# EAGLE board SparkFun RTK Facet L-Band - Main (EAGLE 9.6.2)
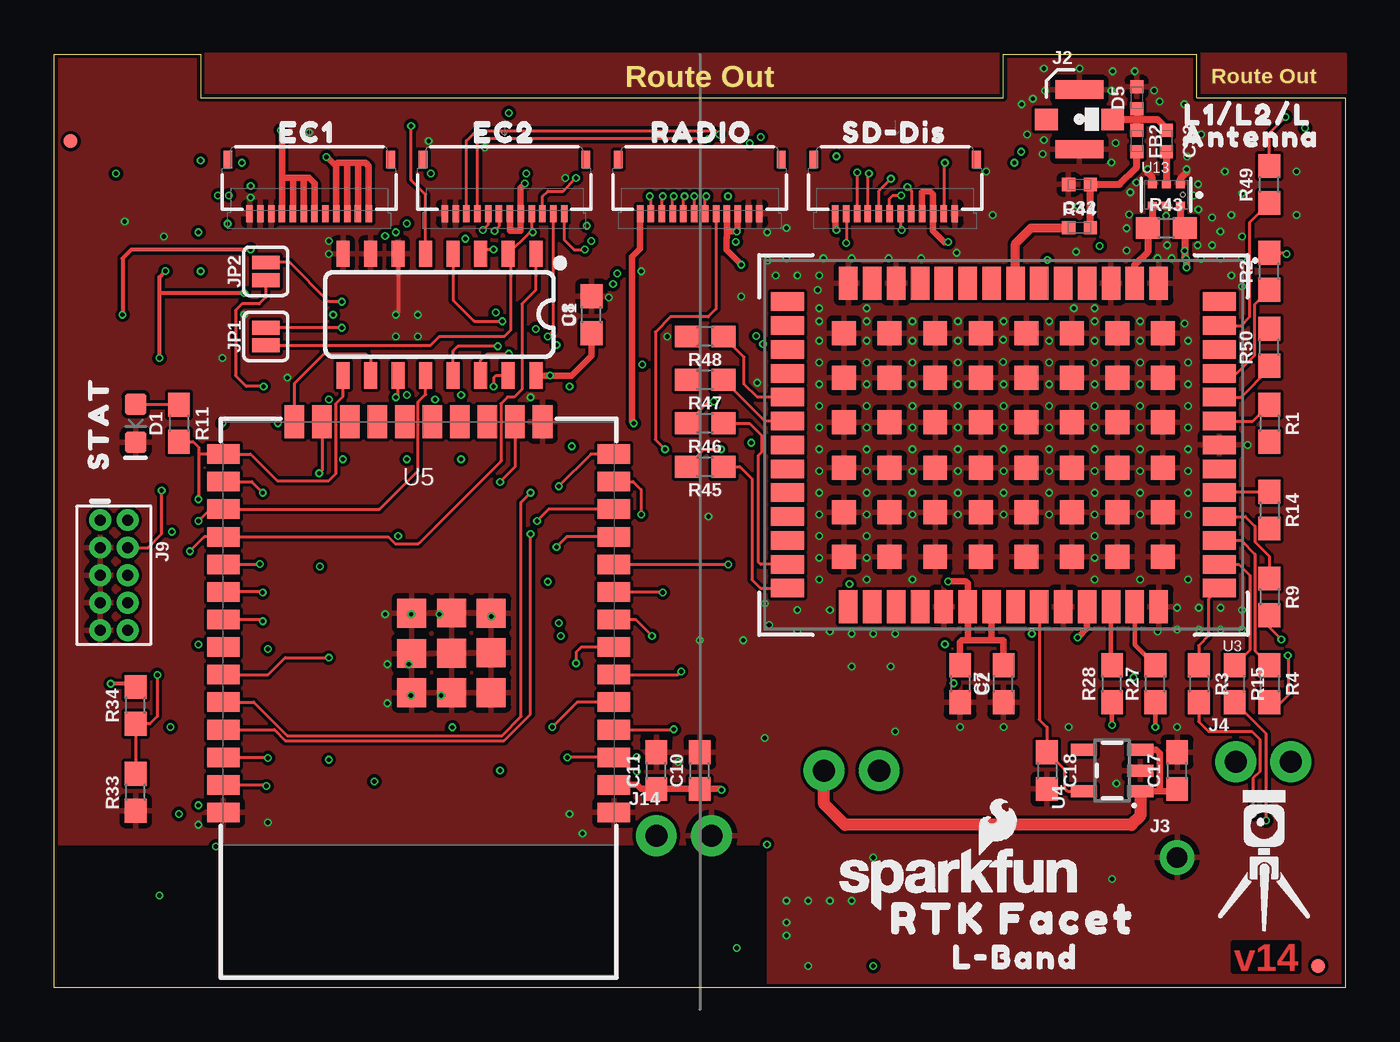
[diagram p2: board, top side]
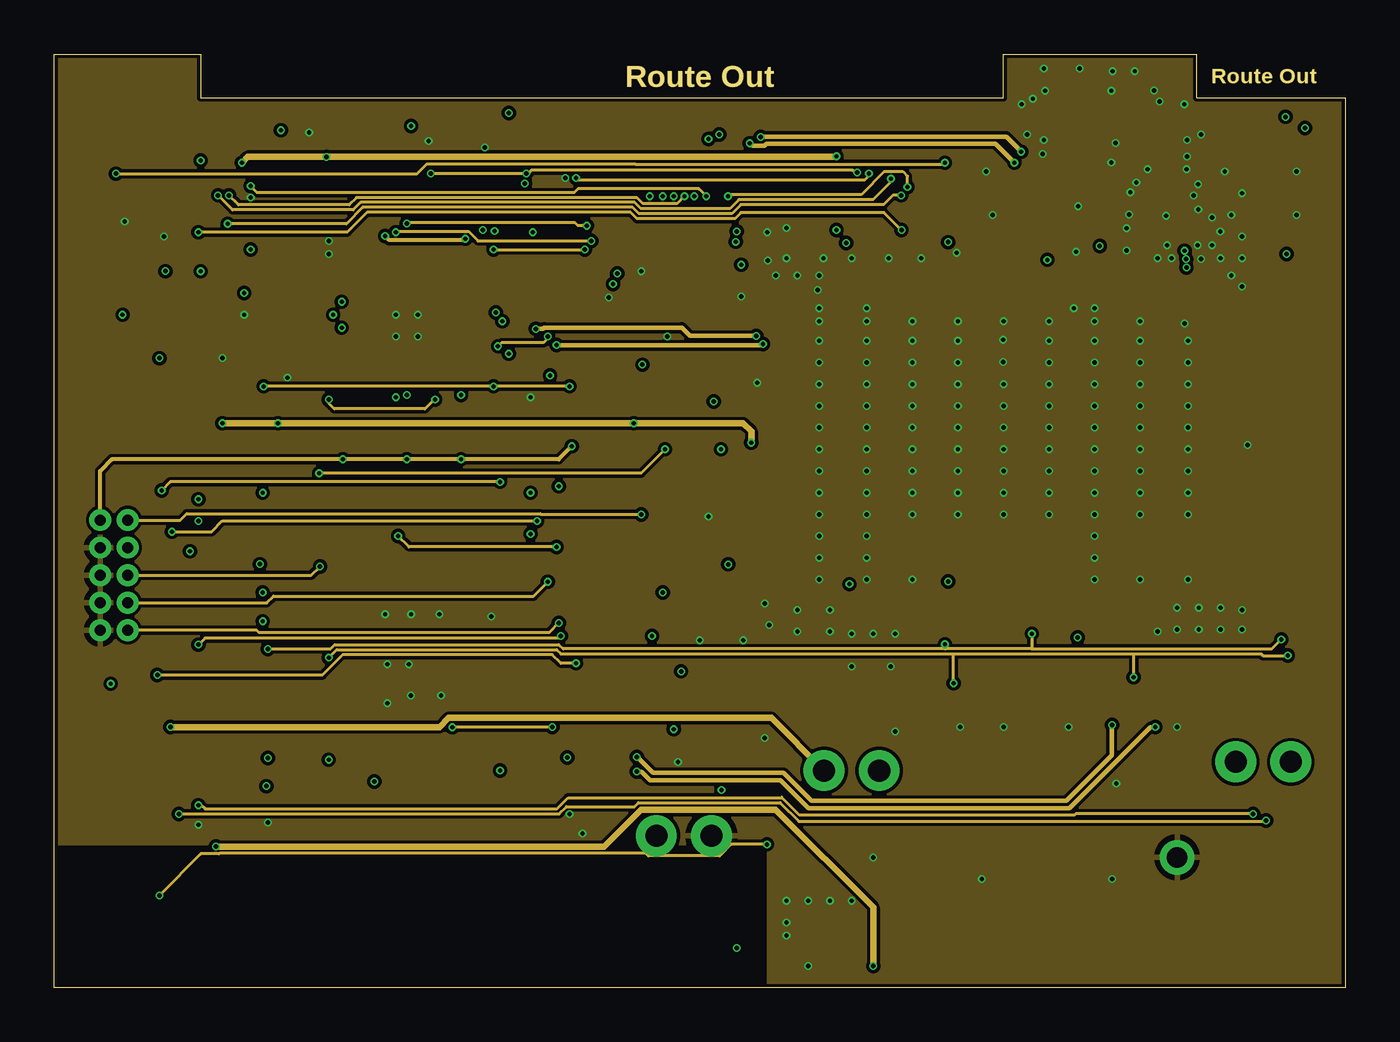
[diagram p3: board, inner layer GND/Horz]
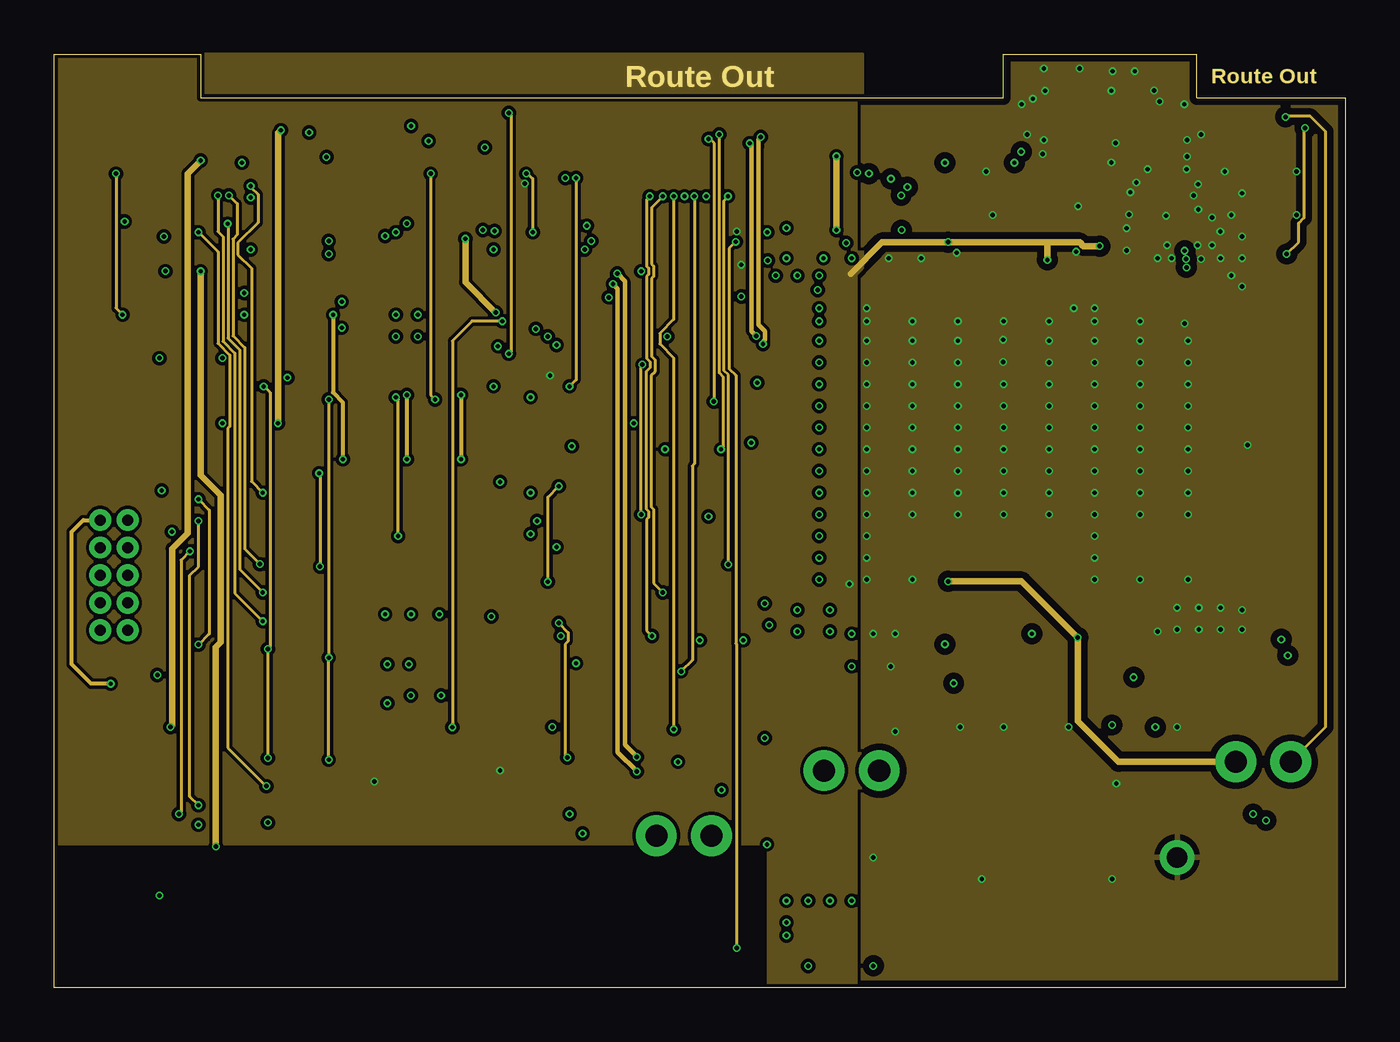
[diagram p4: board, inner layer 3.3V/Vert]
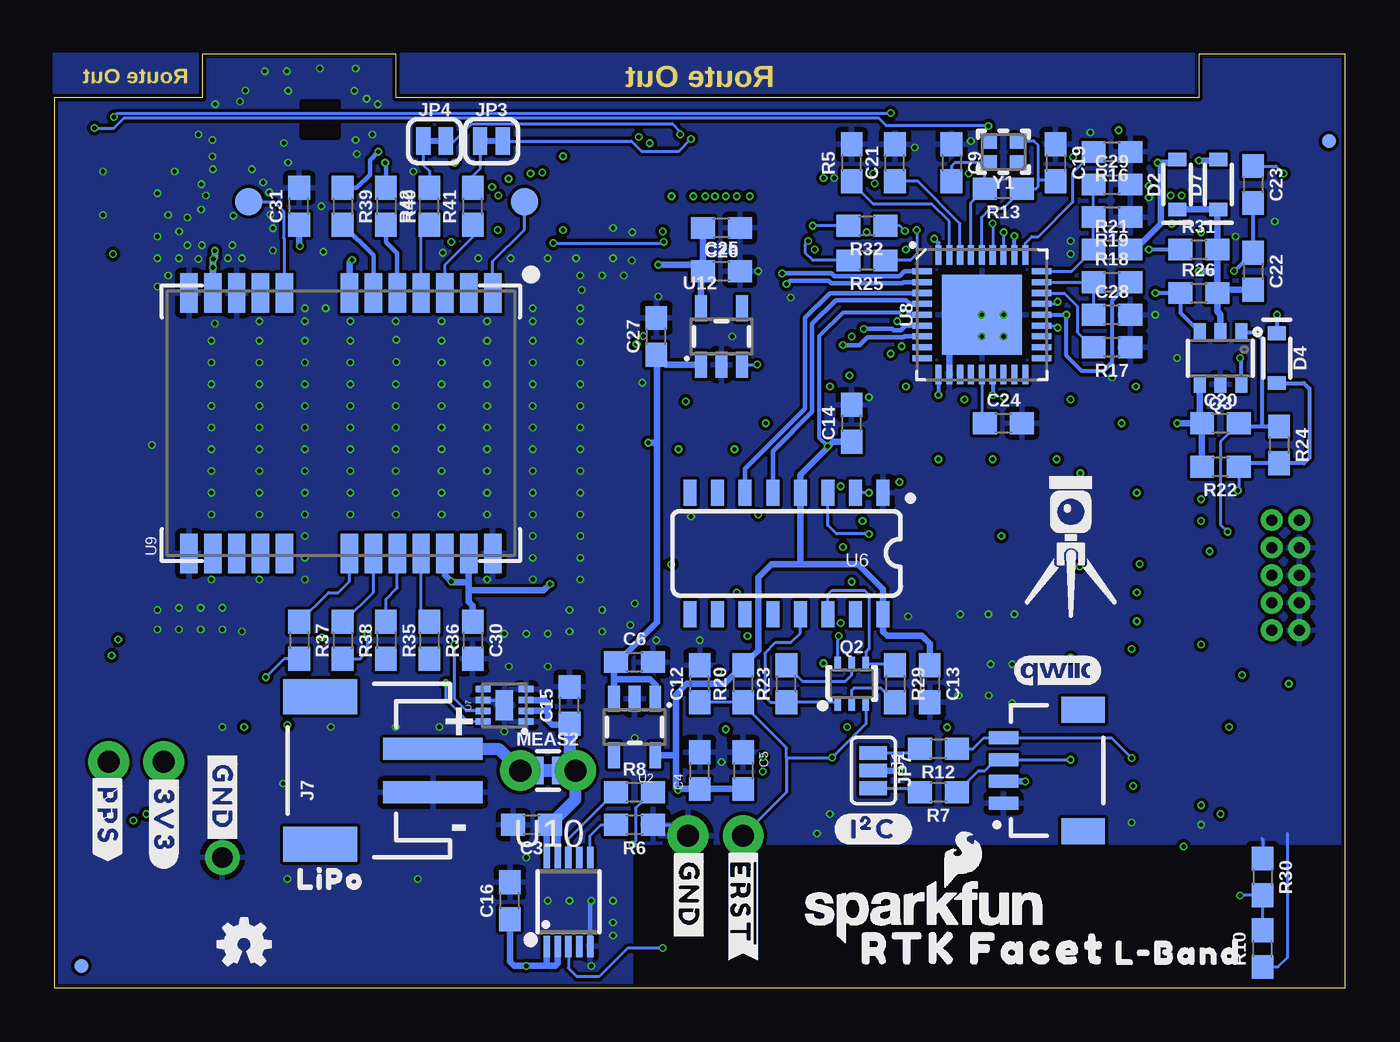
[diagram p5: board, bottom side, seen from below]

Size 59.5 x 43 mm. Coordinates in mm from the lower left corner, seen from the top.
Outline: 59.5,41 59.5,0 0,0 0,43 6.75,43 6.75,41 43.75,41 43.75,43 52.65,43 52.65,41 59.5,41
Copper layers (1+2*15+16): Top/Horz 0.035mm / dielectric 1.5mm / GND/Horz 0.035mm / dielectric 0.15mm / 3.3V/Vert 0.035mm / dielectric 0.2mm / Bottom/Vert 0.035mm
Design rules "SparkFun-4-Layer-MicroMod-JLCPCB": minimum track width 4mil, minimum drill 0.2mm, track to track 4mil, track to pad 4mil, pad to pad 4mil, via to via 4mil, smd to smd 4mil, copper to edge 6mil, drill to drill 6mil, minimum pad ring 3mil, minimum via ring 3mil, stop-mask expansion 2.5mil, vias tented up to drill 25mil, thermal gap 10mil
Net classes: 0 default: width 0.127 mm; 1 power: width 0.178 mm; 2 supply: width 0.406 mm; 3 RF: width 0.33 mm; 4 USB: width 0.203 mm, clearance 0.127 mm
tKeepout: area 0,0 to 2,43; area 57.5,0 to 59.5,43
bKeepout: area 0,0 to 2,43; area 57.5,0 to 59.5,43
tRestrict: area 9.2,35.5 to 9.3,35.8; area 9.7,35.5 to 9.8,35.8; area 18.1,35.5 to 18.4,35.8; area 32.1,35.5 to 32.4,35.8; area 10.2,35.5 to 10.3,35.8; area 18.6,35.5 to 18.9,35.8; area 31.7,35.5 to 31.8,35.8; area 50.2,36.2 to 52.3,36.8

## Footprints (pad centres in the part's own frame; a part is rotated, then mirrored left to right if it is on the bottom)
0603 = smd 1.1 x 1: 1 -0.85,0; 2 0.85,0
0402-TIGHT = smd 0.6 x 0.6: 1 -0.5,0; 2 0.5,0
LED-0603 = smd 1 x 1: A -0.877,0; C 0.877,0
SOD-323 = smd 0.63 x 0.83: A 1.15,0; C -1.15,0
JST04_1MM_RA = smd 0.6 x 1.35: 1 -1.5,0; 2 -0.5,0; 3 0.5,0; 4 1.5,0 | smd 1.2 x 2: NC1 2.8,-3.675; NC2 -2.8,-3.675
U.FL = smd 2.2 x 0.85: 1 0,1.375; 2 0,-1.375 | smd 1.05 x 1: FEED 1.525,0; NC -1.525,0
1X01_NO_SILK = drill 0.95 pad 1.6: 1 0,0
1X02_NO_SILK = drill 1.016 pad 1.88: 1 0,0; 2 2.54,0
JST-2-SMD = smd 1 x 4.6: 1 -1,-3.7; 2 1,-3.7 | smd 1.6 x 3.4: NC1 -3.4,1.5; NC2 3.4,1.5
FPC_12_DOUBLESIDED_BACKFLIP = smd 0.3 x 0.8: 1 -2.75,1.35; 2 -2.25,1.35; 3 -1.75,1.35; 4 -1.25,1.35; 5 -0.75,1.35; 6 -0.25,1.35; 7 0.25,1.35; 8 0.75,1.35; 9 1.25,1.35; 10 1.75,1.35; 11 2.25,1.35; 12 2.75,1.35 | smd 0.4 x 0.8: MP1 -3.75,-1.15; MP2 3.75,-1.15
2X5-PTH-1.27MM = drill 0.508 pad 1: 1 -2.54,-0.635; 2 -2.54,0.635; 3 -1.27,-0.635; 4 -1.27,0.635; 5 0,-0.635; 6 0,0.635; 7 1.27,-0.635; 8 1.27,0.635; 9 2.54,-0.635; 10 2.54,0.635
SMT-JUMPER_2_NO_SILK = smd 0.635 x 1.27: 1 -0.406,0; 2 0.406,0
SMT-JUMPER_2_NC_TRACE_SILK = smd 0.66 x 1.27: 1 -0.521,0; 2 0.521,0
SMT-JUMPER_3_NO_SILK = smd 0.635 x 1.27: 1 -0.813,0; 2 0,0; 3 0.813,0
FIDUCIAL-MICRO = smd 0.635 x 0.635: 1 0,0
COMBO-JUMPER_2_NC_TRACE = smd 0.635 x 1.27: 1 -0.508,0; 2 0.508,0 | drill 1.016 pad 1.88: 3 -1.27,0; 4 1.27,0
SC70-6 = smd 0.3 x 0.66: 1 -0.65,-0.92; 2 0,-0.92; 3 0.65,-0.92; 4 0.65,0.92; 5 0,0.92; 6 -0.65,0.92
SOT26 = smd 0.55 x 0.8: D1 -0.95,1.2; D2 0.95,1.2; G1 -0.95,-1.2; G2 0.95,-1.2; S1 0,1.2; S2 0,-1.2
PAD.03X.05 = smd 1.27 x 1.27: 1 0,0
SO16 = smd 0.6 x 1.2: 1 -4.445,-2.8; 2 -3.175,-2.8; 3 -1.905,-2.8; 4 -0.635,-2.8; 5 0.635,-2.8; 6 1.905,-2.8; 7 3.175,-2.8; 8 4.445,-2.8; 9 4.445,2.8; 10 3.175,2.8; 11 1.905,2.8; 12 0.635,2.8; 13 -0.635,2.8; 14 -1.905,2.8; 15 -3.175,2.8; 16 -4.445,2.8
SOT23-5 = smd 0.55 x 1.2: 1 -0.95,-1.3; 2 0,-1.3; 3 0.95,-1.3; 4 0.95,1.3; 5 -0.95,1.3
ZED-F9P = smd 0.85 x 1.52: 1 -7.15,-7.45; 2 -6.05,-7.45; 3 -4.95,-7.45; 4 -3.85,-7.45; 5 -2.75,-7.45; 6 -1.65,-7.45; 7 -0.55,-7.45; 8 0.55,-7.45; 9 1.65,-7.45; 10 2.75,-7.45; 11 3.85,-7.45; 12 4.95,-7.45; 13 6.05,-7.45; 14 7.15,-7.45; 28 7.15,7.45; 29 6.05,7.45; 30 4.95,7.45; 31 3.85,7.45; 32 2.75,7.45; 33 1.65,7.45; 34 0.55,7.45; 35 -0.55,7.45; 36 -1.65,7.45; 37 -2.75,7.45; 38 -3.85,7.45; 39 -4.95,7.45; 40 -6.05,7.45; 41 -7.15,7.45 | smd 1.52 x 0.85: 15 9.95,-6.6; 16 9.95,-5.5; 17 9.95,-4.4; 18 9.95,-3.3; 19 9.95,-2.2; 20 9.95,-1.1; 21 9.95,0; 22 9.95,1.1; 23 9.95,2.2; 24 9.95,3.3; 25 9.95,4.4; 26 9.95,5.5; 27 9.95,6.6; 42 -9.95,6.6; 43 -9.95,5.5; 44 -9.95,4.4; 45 -9.95,3.3; 46 -9.95,2.2; 47 -9.95,1.1; 48 -9.95,0; 49 -9.95,-1.1; 50 -9.95,-2.2; 51 -9.95,-3.3; 52 -9.95,-4.4; 53 -9.95,-5.5; 54 -9.95,-6.6 | smd 1.1 x 1.1: 55 -1.05,-1.05; 56 -3.15,-1.05; 57 -5.25,-1.05; 58 -7.35,-1.05; 59 -1.05,-3.1; 60 -3.15,-3.1; 61 -5.25,-3.1; 62 -7.35,-3.1; 63 -1.05,-5.15; 64 -3.15,-5.15; 65 -5.25,-5.15; 66 -7.35,-5.15; 67 -1.05,5.15; 68 -3.15,5.15; 69 -5.25,5.15; 70 -7.35,5.15; 71 -1.05,3.1; 72 -3.15,3.1; 73 -5.25,3.1; 74 -7.35,3.1; 75 -1.05,1.05; 76 -3.15,1.05; 77 -5.25,1.05; 78 -7.35,1.05; 79 1.05,1.05; 80 3.15,1.05; 81 5.25,1.05; 82 7.35,1.05; 83 1.05,3.1; 84 3.15,3.1; 85 5.25,3.1; 86 7.35,3.1; 87 1.05,5.15; 88 3.15,5.15; 89 5.25,5.15; 90 7.35,5.15; 91 1.05,-5.15; 92 3.15,-5.15; 93 5.25,-5.15; 94 7.35,-5.15; 95 1.05,-3.1; 96 3.15,-3.1; 97 5.25,-3.1; 98 7.35,-3.1; 99 1.05,-1.05; 100 3.15,-1.05; 101 5.25,-1.05; 102 7.35,-1.05
ESP-WROOM-32D-DFM_PASTE = smd 0.9 x 1.5: 1 6.43,9; 2 5.16,9; 3 3.89,9; 4 2.62,9; 5 1.35,9; 6 0.08,9; 7 -1.19,9; 8 -2.46,9; 9 -3.73,9; 10 -5,9; 11 -6.27,9; 12 -7.54,9; 13 -8.81,9; 14 -10.08,9; 25 -10.08,-9; 26 -8.81,-9; 27 -7.54,-9; 28 -6.27,-9; 29 -5,-9; 30 -3.73,-9; 31 -2.46,-9; 32 -1.19,-9; 33 0.08,-9; 34 1.35,-9; 35 2.62,-9; 36 3.89,-9; 37 5.16,-9; 38 6.43,-9 | smd 1.5 x 0.9: 15 -11.57,5.715; 16 -11.57,4.445; 17 -11.57,3.175; 18 -11.57,1.905; 19 -11.57,0.635; 20 -11.57,-0.635; 21 -11.57,-1.905; 22 -11.57,-3.175; 23 -11.57,-4.445; 24 -11.57,-5.715 | smd 1.33 x 1.33: GND -0.912,1.531; GNDT1 -2.751,3.346; GNDT2 -2.761,1.516; GNDT3 -2.751,-0.314; GNDT4 -0.891,-0.324; GNDT5 0.909,-0.314; GNDT6 0.909,1.516; GNDT7 0.909,3.346; GNDT8 -0.921,3.346
SO016 = smd 0.6 x 1.2: 1 -4.445,-2.8; 2 -3.175,-2.8; 3 -1.905,-2.8; 4 -0.635,-2.8; 5 0.635,-2.8; 6 1.905,-2.8; 7 3.175,-2.8; 8 4.445,-2.8; 9 4.445,2.8; 10 3.175,2.8; 11 1.905,2.8; 12 0.635,2.8; 13 -0.635,2.8; 14 -1.905,2.8; 15 -3.175,2.8; 16 -4.445,2.8
DFN-8 = smd 0.3 x 0.7: 1 -0.75,-0.99; 2 -0.25,-0.99; 3 0.25,-0.99; 4 0.75,-0.99; 5 0.75,0.99; 6 0.25,0.99; 7 -0.25,0.99; 8 -0.75,0.99 | smd 1.38 x 0.8: 9 0,0
QFN-36 = smd 0.9 x 0.28: 1 -2.75,2; 2 -2.75,1.5; 3 -2.75,1; 4 -2.75,0.5; 5 -2.75,0; 6 -2.75,-0.5; 7 -2.75,-1; 8 -2.75,-1.5; 9 -2.75,-2; 19 2.75,-2; 20 2.75,-1.5; 21 2.75,-1; 22 2.75,-0.5; 23 2.75,0; 24 2.75,0.5; 25 2.75,1; 26 2.75,1.5; 27 2.75,2 | smd 0.28 x 0.9: 10 -2,-2.75; 11 -1.5,-2.75; 12 -1,-2.75; 13 -0.5,-2.75; 14 0,-2.75; 15 0.5,-2.75; 16 1,-2.75; 17 1.5,-2.75; 18 2,-2.75; 28 2,2.75; 29 1.5,2.75; 30 1,2.75; 31 0.5,2.75; 32 0,2.75; 33 -0.5,2.75; 34 -1,2.75; 35 -1.5,2.75; 36 -2,2.75 | smd 3.7 x 3.7: EP 0,0
NEO-M9N/M8T/M8U/D9S/F9P = smd 1.8 x 0.8: 1 6,-7; 2 6,-5.9; 3 6,-4.8; 4 6,-3.7; 5 6,-2.6; 6 6,-1.5; 7 6,-0.4; 8 6,2.6; 9 6,3.7; 10 6,4.8; 11 6,5.9; 12 6,7; 13 -6,7; 14 -6,5.9; 15 -6,4.8; 16 -6,3.7; 17 -6,2.6; 18 -6,-0.4; 19 -6,-1.5; 20 -6,-2.6; 21 -6,-3.7; 22 -6,-4.8; 23 -6,-5.9; 24 -6,-7
MSOP10 = smd 0.3 x 1: 1 -1,-2.05; 2 -0.5,-2.05; 3 0,-2.05; 4 0.5,-2.05; 5 1,-2.05; 6 1,2.05; 7 0.5,2.05; 8 0,2.05; 9 -0.5,2.05; 10 -1,2.05
PD0922J5050S2HF_ANA = smd 0.41 x 0.33: 1 0.65,0.483; 2 0,0.483; 3 -0.65,0.483; 4 -0.65,-0.483; 5 0,-0.483; 6 0.65,-0.483
CRYSTAL-SMD-2.0X1.6MM = smd 0.75 x 0.7: 1 -0.675,-0.5; 2 0.675,-0.5; 3 0.675,0.5; 4 -0.675,0.5

## Placement (x,y rotation side)
C2  1.0uF  [0603]  41.75,14 270 top
C3  4.7uF  [0603]  37.5,7.5 180 bottom
C4  1.0uF  [0603]  29.75,10 90 bottom
C5  0.1uF  [0603]  27.75,10 270 bottom
C6  1.0uF  [0603]  32.75,15 0 bottom
C7  0.1uF  [0603]  43.75,14 90 top
C8  0.1uF  [0603]  24.76,31 90 top
C9  18pF  [0603]  18.15,38 270 bottom
C10  10uF  [0603]  29.75,10 90 top
C11  0.1uF  [0603]  27.75,10 90 top
C12  0.1uF  [0603]  29.75,14 90 bottom
C13  0.1uF  [0603]  19.15,14 270 bottom
C14  10uF  [0603]  22.75,26 90 bottom
C15  0.1uF  [0603]  35.75,13 90 bottom
C16  4.7uF  [0603]  38.5,4 90 bottom
C17  1.0uF  [0603]  51.75,10 90 top
C18  1.0uF  [0603]  45.75,10 270 top
C19  18pF  [0603]  13.35,38 270 bottom
C20  10uF  [0603]  5.75,26 0 bottom
C21  0.1uF  [0603]  20.75,38 90 bottom
C22  0.1uF  [0603]  4.25,33 270 bottom
C23  0.1uF  [0603]  4.25,37 270 bottom
C24  0.1uF  [0603]  15.75,26 0 bottom
C25  1.0uF  [0603]  28.75,33 0 bottom
C26  0.1uF  [0603]  28.75,35 180 bottom
C27  1.0uF  [0603]  31.75,30 90 bottom
C28  0.1uF  [0603]  10.75,31 0 bottom
C29  0.1uF  [0603]  10.75,37 0 bottom
C30  1.0uF  [0603]  40.21,16 270 bottom
C31  1.0uF  [0603]  48.21,36 90 bottom
C32  47pF  [0402-TIGHT]  47.25,37 180 top
C33  47pF  [0402-TIGHT]  51.25,39 270 top
D1  Yellow  [LED-0603]  3.75,26 270 top
D2  3A/10V/280mV  [SOD-323]  7.75,37 90 bottom
D4  250mA/100V  [SOD-323]  3.15,29 270 bottom
D5  PESD0402  [0402-TIGHT]  49.89,41 90 top
D7  3A/10V/280mV  [SOD-323]  5.85,37 90 bottom
FB2  2.66Ω  [0402-TIGHT]  49.89,39 270 top
FRAME1  FRAME-LEDGER  [CREATIVE_COMMONS]  83.51,6.35 0 top  (outside the outline)
FRAME2  FRAME-LEDGER  [CREATIVE_COMMONS]  83.51,6.35 0 top  (outside the outline)
J1  QWIIC_RIGHT_ANGLE  [JST04_1MM_RA]  15.75,10 90 bottom
J2  U.FL  [U.FL]  47.25,40 0 top
J3  [1X01_NO_SILK]  51.75,6 0 top
J4  [1X02_NO_SILK]  54.45,10.4 0 top
J7  [JST-2-SMD]  45.75,10 90 bottom
J8  [FPC_12_DOUBLESIDED_BACKFLIP]  38.75,37 180 top
J9  CORTEX_JTAG_DEBUG_PTH  [2X5-PTH-1.27MM]  2.75,19 270 top
J10  [FPC_12_DOUBLESIDED_BACKFLIP]  29.75,37 180 top
J14  [1X02_NO_SILK]  27.75,7 0 top
J15  [FPC_12_DOUBLESIDED_BACKFLIP]  11.75,37 180 top
J18  [FPC_12_DOUBLESIDED_BACKFLIP]  20.75,37 180 top
JP1  [SMT-JUMPER_2_NO_SILK]  9.75,30 90 top
JP2  [SMT-JUMPER_2_NO_SILK]  9.75,33 90 top
JP3  [SMT-JUMPER_2_NC_TRACE_SILK]  39.35,39 0 bottom
JP4  [SMT-JUMPER_2_NC_TRACE_SILK]  41.97,39 0 bottom
JP7  JUMPER-SMT_3_NO_SILK  [SMT-JUMPER_3_NO_SILK]  21.75,10 270 bottom
JP21  FIDUCIALUFIDUCIAL  [FIDUCIAL-MICRO]  58.25,1 0 top
JP61  FIDUCIALUFIDUCIAL  [FIDUCIAL-MICRO]  0.75,39 0 top
JP71  FIDUCIALUFIDUCIAL  [FIDUCIAL-MICRO]  58.25,1 0 bottom
JP81  FIDUCIALUFIDUCIAL  [FIDUCIAL-MICRO]  0.75,39 0 bottom
LOGO1  OSHW-LOGOMINI  [OSHW-LOGO-MINI]  50.75,2 0 bottom
LOGO2  SFE_LOGO_NAME_FLAME.1_INCH  [SFE_LOGO_NAME_FLAME_.1]  41.75,5 0 top
LOGO3  SFE_LOGO_NAME_FLAME.1_INCH  [SFE_LOGO_NAME_FLAME_.1]  19.35,3.5 0 bottom
MEAS2  JUMPER-COMBO_2_NC_TRACE  [COMBO-JUMPER_2_NC_TRACE]  36.75,10 0 bottom
Q2  MBT3904DW1T1  [SC70-6]  22.75,14 0 bottom
Q3  SIL2308  [SOT26]  5.75,29 180 bottom
R1  33  [0603]  56,26 270 top
R2  33  [0603]  56,33 90 top
R3  33  [0603]  52.75,14 270 top
R4  33  [0603]  56,14 270 top
R5  12k  [0603]  22.75,38 90 bottom
R6  1k  [0603]  32.75,7.5 180 bottom
R7  2.2k  [0603]  18.75,9 180 bottom
R8  0  [0603]  32.75,9 0 bottom
R9  33  [0603]  56,18 270 top
R10  10k  [0603]  3.81,1.8 90 bottom
R11  1k  [0603]  5.75,26 270 top
R12  2.2k  [0603]  18.75,11 180 bottom
R13  1M  [0603]  15.75,36.8 180 bottom
R14  33  [0603]  56,22 270 top
R15  33  [0603]  54.4,14 270 top
R16  100k  [0603]  10.75,38.5 180 bottom
R17  100k  [0603]  10.75,29.5 180 bottom
R18  100k  [0603]  10.75,32.5 0 bottom
R19  100k  [0603]  10.75,35.5 180 bottom
R20  10k  [0603]  27.75,14 90 bottom
R21  100k  [0603]  10.75,34 0 bottom
R22  10k  [0603]  5.75,24 180 bottom
R23  10k  [0603]  25.75,14 90 bottom
R24  300k  [0603]  3.05,25 270 bottom
R25  22  [0603]  22.05,33.5 180 bottom
R26  100k  [0603]  6.75,32 0 bottom
R27  27  [0603]  50.75,14 90 top
R28  27  [0603]  48.75,14 90 top
R29  10k  [0603]  20.75,14 270 bottom
R30  150k  [0603]  3.81,5.1 270 bottom
R31  10k  [0603]  6.75,34 0 bottom
R32  22  [0603]  22.05,35.1 180 bottom
R33  1k  [0603]  3.75,9 90 top
R34  4.7k  [0603]  3.75,13 90 top
R35  33  [0603]  44.21,16 270 bottom
R36  33  [0603]  42.21,16 270 bottom
R37  33  [0603]  48.21,16 270 bottom
R38  33  [0603]  46.21,16 270 bottom
R39  27  [0603]  46.21,36 270 bottom
R40  27  [0603]  44.21,36 270 bottom
R41  33  [0603]  40.21,36 90 bottom
R42  33  [0603]  42.21,36 90 bottom
R43  100  [0603]  51.25,35 0 top
R44  10  [0402-TIGHT]  47.25,35 0 top
R45  33  [0603]  30,24 180 top
R46  33  [0603]  30,26 180 top
R47  33  [0603]  30,28 180 top
R48  33  [0603]  30,30 180 top
R49  33  [0603]  56,37 90 top
R50  33  [0603]  56,29.5 90 top
TP1  TEST-POINT3X5  [PAD.03X.05]  50.53,36.21 180 bottom
TP2  TEST-POINT3X5  [PAD.03X.05]  37.83,36.21 180 bottom
U1  74HC4052D  [SO16]  17.75,31 180 top
U2  AP2112K-3.3V  [SOT23-5]  32.75,12 180 bottom
U3  U-BLOX_ZED-F9P  [ZED-F9P]  43.75,25 180 top
U4  STLQ015-3.3V  [SOT23-5]  48.75,10 90 top
U5  ESP-WROOM-3232D-DFMP  [ESP-WROOM-32D-DFM_PASTE]  16.79,14.5 270 top
U6  CH340C  [SO016]  25.75,20 180 bottom
U7  MAX17048  [DFN-8]  38.75,13 90 bottom
U8  USB251XB  [QFN-36]  16.75,31 0 bottom
U9  U-BLOX_NEO-D9S-00B  [NEO-M9N/M8T/M8U/D9S/F9P]  46.29,26 90 bottom
U10  MCP73833MSOP  [MSOP10]  35.8,3.95 0 bottom
U12  AP2112K-3.3V  [SOT23-5]  28.75,30 0 bottom
U13  POWER-DIVIDER  [PD0922J5050S2HF_ANA]  51.25,36.52 0 top
U$1  [LIPO0]  46.75,5 0 bottom
U$2  SPECIAL_INSTRUCTIONS-ORDERING  [ORDERING_INSTRUCTIONS]  63.5,81.28 0 top  (outside the outline)
U$3  [EC21]  20.75,39.4 0 top
U$4  [SD#DIS0]  38.75,39.4 0 top
U$5  [L#BAND0]  44.3,1.4 0 top
U$6  [#3V3#0]  54.45,7.7 270 bottom
U$7  [L#BAND0]  7.7,1.6 0 bottom
U$8  [EC10]  11.65,39.4 0 top
U$10  [#PPS#1]  57.05,7.9 270 bottom
U$11  [RTK_FACET0]  44.2,3.17 0 top
U$12  [RADIO0]  29.85,39.4 0 top
U$13  [RTK_FACET0]  16.65,1.8 0 bottom
U$14  [#GND#1]  51.75,11 270 bottom
U$15  [RTK5#SVG0]  55.76,5.84 0 top
U$16  [RTK5#SVG0]  12.65,20.3 0 bottom
U$17  [ANTENNA1]  55.15,39.21 0 top
U$18  [L1#L2#L0]  55.01,40.22 0 top
U$24  [STAT0]  2.05,26 90 top
U$25  [#I�C#0]  21.75,7.3 0 bottom
U$26  [##ERST##0]  27.75,3.9 270 bottom
U$30  [QWIIC_4MM]  13.25,14.6 0 bottom
U$84  [#GND#1]  30.25,6.5 270 bottom
Y1  24MHz  [CRYSTAL-SMD-2.0X1.6MM]  15.75,38.5 180 bottom

## Tracks (layer width: path | path; a pad name or v marks a point on that pad's centre or on a via)
3.3V  (via drill 0.2)
  Top/Horz 0.305: U1.16 v22.85,28.2 23.85,28.2 24.76,29.11 C8.1 | C7.2 43.75,16 43.25,16 43.24,16.01 | 43.24,16.01 43.2,16.05 U3.34 | v21.69,37.04 21.5,36.85 J18.5 21.5,34.87 21.02,34.87 21,34.89 J18.6 | J8.4 40,36.65 40.05,36.7 40.35,36.7 40.5,36.55 J8.3 40.5,34.86 41.02,34.34 v41.2,34.34 | J10.3 31.5,34.85 31.46,34.85 v31.45,34.84 31.04,34.84 31,34.8 | 43.24,16.01 42.09,16.01 | 42.09,16.01 41.84,16.01 41.75,15.92 C2.1 | 42.09,16.01 42.1,16.02 U3.33 42.1,18.62 42,18.71 v41.2,18.71 | U3.38 47.6,16.56 v47.17,16.13 | J10.4 31,34.8 | 31,34.8 31,34.56 30.98,34.54 30.98,33.99 v31.67,33.3
  3.3V/Vert 0.305: v48.19,34.16 47.44,34.16 47.27,34.33 45.73,34.33 | v45.77,33.53 45.77,34.29 45.73,34.33 | 36.72,32.89 38.15,34.33 41.25,34.33 | 45.73,34.33 41.25,34.33 | v41.2,34.34 41.24,34.34 41.25,34.33 | J4.1 49.05,10.4 47.17,12.28 v47.17,16.13 44.58,18.71 v41.2,18.71
  Bottom/Vert 0.305: C26.2 29.6,33.3 | 29.6,33.3 C25.1 29.7,32.9 U12.5 | v31.67,33.3 29.6,33.3 | J1.2 v14.75,9.5 | JP7.2 v20.55,10 | U9.7 45.89,33.41 v45.77,33.53 | C31.1 48.21,34.19 v48.19,34.16 | C30.1 40.21,17.59 40.4,17.78 40.4,18.3 | 40.4,18.3 40.4,18.67 | 40.4,18.67 U9.23 | U9.22 41.49,19 v41.2,18.71 41.15,18.67 40.4,18.67 | 40.4,18.3 36.94,18.3 v36.65,18.59
  pour 3.3V/Vert (isolate 0.152, rank 4): 0,43 37.25,43 37.25,0 0,0
CHG_LED  (via drill 0.2)
  Top/Horz 0.127: v36.5,34.3 J8.11
  3.3V/Vert 0.127: v31.45,1.82 31.45,15.82 31.41,15.86 31.41,28.2 31.11,28.51 31.11,34.06 v31.41,34.36
  Bottom/Vert 0.127: v31.41,34.36 31.47,34.3 v36.5,34.3 | U10.3 35.8,0.9 35.4,0.5 34.4,0.5 33.08,1.82 v31.45,1.82
CHG_THERM1  (via drill 0.2)
  GND/Horz 0.127: v32.85,6.6 31.2,6.6 30.67,6.07 27.37,6.07 27.26,6.18 7.62,6.18 7.59,6.16 6.76,6.16 v4.85,4.25
  Bottom/Vert 0.127: R10.2 R30.2 v4.85,4.25 | v32.85,6.6 32.72,6.74 32.72,8.27 31.98,9 R8.2
ESP32_!DTR
  Bottom/Vert 0.127: Q2.1 23.47,13.15 R23.1 26.5,13.15 26.75,13.4 26.75,15.4 26.25,15.9 25.55,15.9 25.11,16.34 U6.13
ESP32_!RTS
  Bottom/Vert 0.127: R29.1 20.82,14.92 Q2.4 22.1,15.46 21.95,15.61 21.95,18.1 22.15,18.3 23.65,18.3 23.84,18.11 U6.14
ESP32_EN  (via drill 0.2)
  Top/Horz 0.127: U5.3 v23.66,10.61 v23.65,10.6
  GND/Horz 0.127: J9.10 9.34,16.46 9.44,16.36 22.81,16.36 v23.25,16.8
  3.3V/Vert 0.127: v23.25,16.8 23.69,16.36 23.69,15.96 23.55,15.82 23.55,10.7 v23.65,10.6
  Bottom/Vert 0.127: R20.1 27.85,13.15 | 27.85,13.15 C12.1 | 27.85,13.15 25.75,11.05 25.75,10.6 | 25.75,10.6 v23.65,10.6 22.1,12.15 Q2.3 | 25.75,10.6 25.75,9 J14.1
ESP32_RXI  (via drill 0.2)
  Top/Horz 0.127: v21.95,22.8 21.52,22.37 21.52,12.49 20.64,11.61 10.74,11.61 9.2,13.15 U5.34
  Bottom/Vert 0.127: v21.95,22.8 U6.2
ESP32_TXO  (via drill 0.2)
  Top/Horz 0.127: v21.95,20.9 21.95,12.6 20.73,11.38 10.65,11.38 10.15,11.88 U5.35
  Bottom/Vert 0.127: v21.95,20.9 23.45,20.9 23.84,21.3 U6.3
ESP_0/BOOT/STAT_LED/MUX_B  (via drill 0.2)
  Top/Horz 0.127: U1.9 13.3,27.23 12.96,26.89 12.96,23.67 12.65,23.36 10.27,23.36 9.05,24.58 U5.25 6.71,24.58 6.65,24.64 | R11.2 6.4,25.15 6.65,24.9 6.65,24.64 | 6.65,24.64 v6.65,22.5
  GND/Horz 0.127: v23.35,16.2 23.25,16.1 6.95,16.1 v6.65,15.8
  3.3V/Vert 0.127: v6.65,22.5 7.15,22 7.15,16.3 v6.65,15.8
  Bottom/Vert 0.127: v23.35,16.2 23.4,16.15 Q2.6
ESP_2/MUX_A
  Top/Horz 0.127: U5.24 11.07,27.84 12.43,29.2 14.35,29.2 14.57,28.98 U1.10
ESP_3V3  (via drill 0.2)
  Top/Horz 0.178: R34.2 3.6,14 v2.6,14
  Top/Horz 0.305: v30.75,9.1 30.7,9.15 C10.1 C11.1 27.05,9.15 26.86,9.34 U5.2
  GND/Horz 0.178: J9.1 2.12,23.8 2.66,24.34 v13.3,24.34 v16.25,24.34 v18.75,24.34 23.25,24.34 v23.85,24.94 | v18.95,34.5 18.95,34.48 18.9,34.43 15.44,34.43 v15.25,34.63
  3.3V/Vert 0.178: v12.85,31 12.85,27.42 13.3,26.97 v13.3,24.34 | v16.25,27.3 v16.25,24.34 | v18.75,27.3 v18.75,24.34 | v2.6,14 1.7,14 0.8,14.9 0.8,21 1.34,21.54 J9.1
  3.3V/Vert 0.305: v18.95,34.5 18.95,32.5 v20.35,31.1
  Bottom/Vert 0.178: U8.10 v18.75,27.3 | U8.5 20.3,31 20.35,31.05 v20.35,31.1 23.15,31.1 24.25,30 24.25,25.34 v23.85,24.94 | U8.36 18.75,34.3 v18.95,34.5 | U8.29 v15.25,34.63 | U8.23 v12.85,31 12.85,29.1 12.15,28.4 11.15,28.4 10.75,28.8 10.75,31.65 R18.2 | U8.15 v16.25,27.3
  Bottom/Vert 0.305: 30.85,10.7 30.85,13.5 30.35,14 28.6,14 R20.2 27.05,15.55 27.05,18.9 26.45,19.5 25.15,19.5 | 30.85,10.7 30.85,9.2 v30.75,9.1 30.7,9.15 C10.1 C11.1 | U2.5 30.85,10.7 | 30.85,10.7 | C13.1 19.15,15.85 19.5,16.2 21.11,16.2 21.3,16.4 U6.16 21.3,18.34 21.3,18.35 22.45,19.5 25.15,19.5 | 25.15,19.5 25.11,19.54 U6.4 25.11,23.64 23.85,24.9 | C14.1 23.6,25.15 23.85,24.9 | v23.85,24.94 23.85,24.9
ESP_4/RADIO_PWR_ON  (via drill 0.2)
  Top/Horz 0.127: J10.6 30,36.41 v30.05,36.46 | U5.26 9.1,23.31 v9.61,22.8
  GND/Horz 0.127: v30.05,36.46 29.71,36.8 24.13,36.8 23.96,36.63 9.35,36.63 v9.05,36.93
  3.3V/Vert 0.127: v9.05,36.93 9.05,36.88 9.39,36.54 9.39,35.24 8.46,34.31 8.46,33.77 9.09,33.14 9.09,23.32 v9.61,22.8
ESP_5/RADIO_CTSI  (via drill 0.2)
  Top/Horz 0.127: J10.8 29,36.41 v29.05,36.46 | U5.29 v9.48,19.51
  GND/Horz 0.127: v8.05,36.5 8.49,36.06 13.59,36.06 13.93,36.4 26.85,36.4 27.13,36.12 28.69,36.12 29.03,36.46 v29.05,36.46
  3.3V/Vert 0.127: v8.05,36.5 8.44,36.11 8.44,34.69 8.24,34.49 8.24,30.02 8.78,29.48 8.78,20.21 v9.48,19.51
ESP_12/MTDI  (via drill 0.2)
  Top/Horz 0.127: U5.14 24.73,24.58 v23.25,23.1
  GND/Horz 0.127: J9.8 9.79,17.73 10.1,18.04 22.09,18.04 v22.75,18.7
  3.3V/Vert 0.127: v22.75,18.7 22.75,22.6 v23.25,23.1
ESP_13/POWER_CTRL/MTCK  (via drill 0.2)
  Top/Horz 0.127: J9.4 4.32,20.27 4.95,20.9 v4.95,22.9 | U5.16 21.23,23.98 v20.55,23.3
  GND/Horz 0.127: v20.55,23.3 5.35,23.3 v4.95,22.9
  Bottom/Vert 0.127: v4.95,22.9 4.88,22.98 4.88,24.02
  Bottom/Vert 0.178: D4.A 1.9,27.85 1.65,27.6 1.65,24.4 1.9,24.15 R24.2 4.75,24.15 4.88,24.02 R22.1
ESP_14/PERIPHERAL_POWER/MTMS  (via drill 0.2)
  Top/Horz 0.127: U5.13 26.68,23.31 27.05,22.94 v27.05,21.8
  GND/Horz 0.127: J9.2 5.81,21.54 6.11,21.84 22.39,21.84 22.43,21.8 v27.05,21.8
  3.3V/Vert 0.127: v27.05,21.8 27.05,28.64 v27.11,28.7
  Bottom/Vert 0.127: U12.3 v27.11,28.7
ESP_15/MTDO/RADIO_!RESET!  (via drill 0.2)
  Top/Horz 0.127: J10.5 30.5,31.27 30.13,30.9 28.4,30.9 27.7,30.2 27.7,25.25 v28.15,24.8 | U5.23 12.35,23.84 v12.21,23.7
  GND/Horz 0.127: v28.15,24.8 27.05,23.7 v12.21,23.7 | J9.6 11.85,19 v12.25,19.4
  3.3V/Vert 0.127: v12.21,23.7 12.25,23.66 v12.25,19.4
ESP_16/ZED_TXO1  (via drill 0.2)
  Top/Horz 0.127: U1.12 17.11,27.33 16.77,26.99 16.77,23.82 14.99,22.04 U5.27 7.19,22.04 v6.65,21.5 | v55.25,8 55.25,9.64 55.55,9.94 55.55,11.45 55.2,11.8 53.2,11.8 52.75,12.25 R3.2
  GND/Horz 0.127: v55.25,8 47.07,8 47.02,7.94 34.36,7.94 33.52,8.78 33.5,8.75 23.69,8.75 23.17,8.23 6.95,8.23 6.78,8.4 v6.65,8.4
  3.3V/Vert 0.127: v6.65,21.5 6.65,19.4 6.25,19 6.25,8.8 v6.65,8.4
ESP_17/ZED_RXI1  (via drill 0.2)
  Top/Horz 0.127: U1.1 22.2,32.15 21.55,31.5 21.55,27.56 21.19,27.2 20.89,27.2 20.59,26.9 20.59,24.26 16.79,20.46 15.71,20.46 15.4,20.77 U5.28 6.92,20.77 v6.25,20.1 | v55.85,7.7 55.85,11.7 R15.2
  GND/Horz 0.127: v55.85,7.7 55.81,7.66 34.32,7.66 33.46,8.52 26.92,8.52 26.74,8.34 23.61,8.34 23.27,8 v5.75,8
  3.3V/Vert 0.127: v6.25,20.1 5.85,19.7 5.85,8.1 v5.75,8
ESP_18/SD_SCK  (via drill 0.2)
  Top/Horz 0.127: J8.7 38.5,36.35 38.65,36.5 v39.03,36.5 | v9.61,18.21 9.59,18.23 U5.30
  GND/Horz 0.127: v39.03,36.5 38.65,36.5 38.22,36.07 31.64,36.07 31.23,35.66 26.94,35.66 26.66,35.94 14.22,35.94 13.47,35.19 v7.99,35.19
  3.3V/Vert 0.127: v9.61,18.21 8.55,19.27 8.55,29.38 8.01,29.93 8.01,35.17 v7.99,35.19
ESP_19/SD_CIPO  (via drill 0.2)
  Top/Horz 0.127: J8.8 38,36.7 v38.56,37.26 | U5.31 9.53,16.96 v9.61,16.88
  GND/Horz 0.127: v38.56,37.26 38.56,37.13 37.72,36.3 31.55,36.3 31.14,35.89 27.04,35.89 26.75,36.17 14.13,36.17 13.79,35.83 8.22,35.83 v7.55,36.5
  3.3V/Vert 0.127: v7.55,36.5 7.55,34.82 7.78,34.59 7.78,29.78 8.32,29.24 8.32,18.17 v9.61,16.88
ESP_21/SDA  (via drill 0.2)
  Top/Horz 0.127: v37,37.55 J8.10 | JP1.1 17.34,29.59 17.75,30 20.75,30 21.05,30.3 21.05,33.8 U1.2 21.93,34.8 v22.05,34.8 22,34.85 J18.4 | v12.65,15.2 10.65,15.2 9.87,14.42 U5.33 | R4.2 56.55,13.15 56.9,13.5 56.9,15.25 v56.85,15.3
  GND/Horz 0.127: v17.55,27.1 17.53,27.1 17.09,26.66 12.91,26.66 12.65,26.92 v12.65,27.1 | v17.35,37.5 v21.75,37.5 21.85,37.5 22.01,37.66 36.79,37.66 36.9,37.55 v37,37.55 | v12.65,15.2 13.02,15.57 23.16,15.57 23.36,15.37 41.45,15.37 | v56.85,15.3 55.71,15.3 55.64,15.37 49.75,15.37 | 41.45,15.37 49.75,15.37 | v49.75,14.3 49.75,15.37 | v41.45,14.02 41.45,15.37
  3.3V/Vert 0.127: v17.35,37.5 17.35,27.3 v17.55,27.1 | v12.65,27.1 v12.65,15.2 v12.65,10.5 | v21.75,37.5 21.82,37.5 22.05,37.27 v22.05,34.8
  Bottom/Vert 0.127: U7.8 40.42,12.25 41.45,13.28 v41.45,14.02 | v12.65,10.5 J1.3 16.1,10.5 16.6,10 16.9,10 R7.1 | R37.2 48.9,15.15 v49.75,14.3
ESP_22/SCL  (via drill 0.2)
  Top/Horz 0.127: J8.9 37.5,37.45 v37.55,37.5 | J18.3 22.5,36.45 22.75,36.7 23.45,36.7 v24.05,37.3 | JP2.1 9.75,31.8 9.45,31.5 8.65,31.5 8.35,31.2 8.35,28.2 8.85,27.7 v9.65,27.7 | U1.15 20.35,28.2 20.25,28.1 v20.25,27.7 | U5.36 9.82,10.61 v9.85,10.58 | R9.2 56,16.59 v56.55,16.04
  GND/Horz 0.127: 45.05,15.6 41.05,15.6 | v37.55,37.5 37.55,37.4 37.35,37.2 24.15,37.2 v24.05,37.3 | v23.75,27.7 v20.25,27.7 v9.65,27.7 | v9.85,15.6 12.73,15.6 12.93,15.8 23.25,15.8 23.45,15.6 41.05,15.6 | v45.06,16.3 45.06,15.61 45.05,15.6 | v41.05,15.82 41.05,15.6 | v56.55,16.04 56.11,15.6 45.05,15.6
  3.3V/Vert 0.127: v9.85,10.58 v9.85,15.6 9.95,15.7 9.95,27.42 9.67,27.7 v9.65,27.7 | v24.05,37.3 24.05,28 v23.75,27.7
  Bottom/Vert 0.127: U7.7 40.5,12.75 41.05,13.3 v41.05,15.82 | v9.85,10.58 10.77,11.5 J1.4 16.65,11.5 17.15,11 R12.1 | R38.2 45.4,15.15 45.06,15.49 v45.06,16.3
ESP_23/SD_COPI  (via drill 0.2)
  Top/Horz 0.127: J8.6 39,34.95 v39.05,34.9 | U5.37 9.72,9.34 v9.78,9.28
  GND/Horz 0.127: v39.05,34.9 38.25,35.7 31.65,35.7 31.38,35.43 26.85,35.43 26.57,35.71 14.42,35.71 13.5,34.8 v6.65,34.8
  3.3V/Vert 0.127: v6.65,34.8 7.55,33.9 7.55,29.68 8.09,29.14 8.09,25.86 8,25.77 8,11.06 v9.78,9.28
ESP_25/SD_!CS!  (via drill 0.2)
  Top/Horz 0.127: v39.32,36.88 39.5,36.7 J8.5 | U5.10 v31.07,19.5
  GND/Horz 0.127: v39.32,36.88 39.32,37.39 39.11,37.6 38.27,37.6 37.2,36.53 31.12,36.53 v31.05,36.46
  3.3V/Vert 0.127: v31.05,36.46 31.07,36.44 30.88,36.25 30.88,28.41 31.07,28.22 v31.07,19.5
ESP_26/DAC2  (via drill 0.2)
  Top/Horz 0.127: v15.75,27.2 15.85,27.3 U1.11 | U5.11 23.62,20.77 v23.15,20.3
  GND/Horz 0.127: v23.15,20.3 16.35,20.3 v15.85,20.8
  3.3V/Vert 0.127: v15.85,20.8 15.85,27.1 v15.75,27.2
ESP_27/FAST_OFF  (via drill 0.2)
  Top/Horz 0.127: U5.12 22.79,22.04 v22.25,21.5
  GND/Horz 0.127: v22.25,21.5 7.75,21.5 7.25,21 v5.42,21
  Bottom/Vert 0.127: C20.2 5.75,25.15 5.75,21.33 v5.42,21
  Bottom/Vert 0.178: Q3.G1 4.15,30.2 3.85,29.9 3.85,25.85 | R24.1 3.85,25.85 | 3.85,25.85 4.75,25.85 C20.2
ESP_32/RADIO_TXO  (via drill 0.2)
  Top/Horz 0.127: J10.11 27.5,36.41 v27.45,36.46 | U5.8 26.79,16.96 v27.55,16.2
  3.3V/Vert 0.127: v27.45,36.46 27.3,36.31 27.3,33.23 27.39,33.14 27.39,32.86 27.3,32.77 27.3,28.99 27.45,28.84 27.45,28.55 27.28,28.38 27.28,22.05 27.39,21.94 27.39,21.66 27.3,21.57 27.3,16.45 v27.55,16.2
ESP_33/RADIO_RXI  (via drill 0.2)
  Top/Horz 0.127: J10.10 28,36.41 v28.05,36.46 | U5.9 28.02,18.23 v28.05,18.2
  3.3V/Vert 0.127: v28.05,36.46 27.53,35.94 27.53,33.33 27.62,33.24 27.62,32.76 27.53,32.67 27.53,29.09 27.68,28.94 27.68,28.38 27.51,28.21 27.51,22.15 27.62,22.04 27.62,18.63 v28.05,18.2
ESP_DM
  Bottom/Vert 0.203: U8.3 23.75,32 24.9,30.85 24.9,26.67 27.66,23.91 U6.6
ESP_DP
  Bottom/Vert 0.203: U6.5 26.39,24.71 24.57,26.53 24.57,30.58 23.48,31.67 20.24,31.67 20.07,31.5 U8.4
ESP_I34/RADIO_INT  (via drill 0.2)
  Top/Horz 0.127: J10.7 v29.5,36.45 v29.5,36.46 | U5.6 28.74,14.42 v28.89,14.57
  3.3V/Vert 0.127: v29.5,36.46 29.5,24.14 29.41,24.04 29.41,15.09 v28.89,14.57
ESP_I35/DEVICE_SENSE  (via drill 0.2)
  Top/Horz 0.127: v4.75,14.4 4.75,12.5 4.4,12.15 R34.1 R33.2 | U5.7 24.28,15.69 24.05,15.46 v24.05,14.94
  GND/Horz 0.127: v4.75,14.4 12.35,14.4 13.29,15.34 22.95,15.34 23.35,14.94 v24.05,14.94
ESP_I36/RADIO_RTSO  (via drill 0.2)
  Top/Horz 0.127: J10.9 28.5,36.41 v28.55,36.46 | U5.4 28.53,11.88 v28.55,11.9
  3.3V/Vert 0.127: v28.55,36.46 28.55,30.78 27.91,30.14 27.91,29.66 28.55,29.02 v28.55,11.9
ESP_I39/ADC39  (via drill 0.2)
  Top/Horz 0.127: U5.5 24.1,13.15 v22.95,12 | U1.4 18.39,31.66 19.35,30.7 v20.65,30.7
  GND/Horz 0.127: v22.95,12 v18.36,12 v18.35,11.99
  3.3V/Vert 0.127: v20.65,30.7 19.25,30.7 18.35,29.8 v18.35,11.99
EXTERNAL_SERIAL1_RXI  (via drill 0.2)
  Top/Horz 0.127: J18.1 23.5,34.45 23.95,34 v24.45,34 | U1.3 19.86,34 v20.25,34
  GND/Horz 0.127: v20.25,34 v24.45,34
EXTERNAL_SERIAL1_TXO  (via drill 0.2)
  Top/Horz 0.127: U1.13 18.39,29.34 18.6,29.55 v20.45,29.55 | J18.2 23,30.25 v22.75,30
  GND/Horz 0.127: v20.45,29.55 20.62,29.72 22.55,29.72 22.75,29.92 v22.75,30
FENCE_LV
  Top/Horz 0.127: U3.19 32.4,27.2 31.8,27.8 31.8,29.05 R48.1
GND  (via drill 0.2)
  Top/Horz 0.178: U1.6 15.85,31.09 v15.75,31
  Top/Horz 0.33: U13.3 50.6,37.32 50.39,37.53 v50.39,37.7 | U13.1 51.9,37.27 52.19,37.56 v52.19,37.7
  Bottom/Vert 0.127: U7.6 39,13.25 U7.9 | 3.84,6.87 3.81,6.84 R30.1 | R6.1 30.79,7.5 J14.2 | R10.1 3.1,0.95 2.65,1.4 2.65,7.1
  Bottom/Vert 0.203: U10.5 34.8,3.95 v34.75,4
  Bottom/Vert 0.305: U8.11 18.25,29.76 18.01,30 v16.75,30
  other vias: 8.75,31 10.75,28.1 15.75,30 16.75,31 12.65,33.8 12.65,34.4 9.05,36.4 11.75,39.4 19.85,38.7 23.55,37.3 27.05,33 25.55,31.8 28.25,30 21.95,27.2 7.75,29 3.25,35.3 5.05,34.6 6.65,7.5 9.85,7.6 23.75,8 24.35,7.1 28.75,10.4 29.75,16 31.75,16 32.75,11.5 36.75,14.8 38.55,14.8 41.75,12 43.75,12 46.75,12 48.95,9.4 51.75,12 48.75,5 42.75,5 37.75,6 34.75,1 15.35,13.1 15.35,14.9 16.35,14.9 16.43,13.46 17.83,13.46 20.15,17.1 17.75,17.2 16.45,17.2 15.25,17.2 30.15,21.7 45.55,38.4 48.72,38.02 50.85,33.6 51.49,33.6 53.75,33.6 54.75,33.6 54.75,32.3 41.59,33.85 39.95,33.6 38.45,33.6 36.75,33.6 35.45,33.6 33.75,33.6 32.89,33.5 35.19,32.13 31.66,31.84 32.4,27.86 32.75,17.7 32.95,16.7 34.25,16.4 35.75,16.4 36.75,16.3 37.75,16.3 38.75,16.3 50.85,16.4 51.75,16.5 52.75,16.5 53.75,16.5 54.75,16.5 54.75,17.4 47.95,19.8 37.45,19.8 35.25,19.8 50.05,30.7 47.95,30.7 45.85,30.7 43.75,30.7 41.65,30.7 39.55,30.7 37.45,30.7 35.25,30.7 50.05,29.8 47.95,29.8 45.85,29.8 41.65,29.8 39.55,29.8 37.45,29.8 35.25,29.8 52.25,29.8 50.05,28.8 47.95,28.8 45.85,28.8 41.65,28.8 39.55,28.8 37.45,28.8 35.25,28.8 52.25,28.8 50.05,27.8 47.95,27.8 45.85,27.8 43.75,27.8 41.65,27.8 39.55,27.8 37.45,27.8 35.25,27.8 52.25,27.8 50.05,26.8 47.95,26.8 45.85,26.8 43.75,26.8 41.65,26.8 39.55,26.8 37.45,26.8 35.25,26.8 52.25,26.8 50.05,25.8 47.95,25.8 45.85,25.8 43.75,25.8 41.65,25.8 39.55,25.8 37.45,25.8 35.25,25.8 52.25,25.8 50.05,24.8 47.95,24.8 45.85,24.8 43.75,24.8 41.65,24.8 39.55,24.8 37.45,24.8 35.25,24.8 52.25,24.8 50.05,23.8 47.95,23.8 45.85,23.8 43.75,23.8 41.65,23.8 39.55,23.8 37.45,23.8 35.25,23.8 52.25,23.8 50.05,22.8 47.95,22.8 45.85,22.8 43.75,22.8 41.65,22.8 39.55,22.8 37.45,22.8 35.25,22.8 52.25,22.8 50.05,21.8 47.95,21.8 45.85,21.8 43.75,21.8 41.65,21.8 39.55,21.8 37.45,21.8 35.25,21.8 52.25,21.8 47.95,20.8 37.45,20.8 35.25,20.8 50.05,18.8 47.95,18.8 39.55,18.8 37.45,18.8 35.25,18.8 52.25,18.8 47.95,31.3 37.45,31.3 35.25,31.3 34.25,17.4 35.75,17.4 51.75,17.5 52.75,17.5 53.75,17.5 35.25,32.8 34.25,32.8 33.25,32.8 54.25,32.8 42.95,37.6 43.25,35.6 54.75,34.6 49.42,33.97 57.25,37.6 53.95,37.6 54.75,36.6 54.25,35.6 57.25,35.6 38.75,11.8 35.75,4 36.75,4 33.75,4 33.75,3 33.75,2.4 45.67,41.32 48.72,41.32 33.75,35 32.86,34.8 17.25,39 43.74,28.83 43.74,29.84 49.42,34.98 49.87,37.09 52.72,37.01 48.91,38.92 45.61,39.05 47.26,42.35 49.8,42.22 50.69,41.33 50.94,40.82 52.09,40.7 52.85,39.3 52.21,39.05 52.21,38.28 52.85,33.57 53.36,34.2 53.74,34.84 53.36,35.47 52.73,35.85 49.55,35.62 44.85,39.3 44.59,40.7 45.1,40.95 45.61,42.35 48.78,42.22 51.29,34.2 52.69,34.2 47.09,33.9 46.99,31.3 52.09,30.6 54.99,25 47.19,36 49.59,36.65 52.51,36.49 51.25,35.56
  pour Top/Horz (isolate 0.152, rank 4): 0,43 59.5,43 59.5,0 0,0
  pour Bottom/Vert (isolate 0.152, rank 4): 0,43 59.5,43 59.5,0 0,0
  pour GND/Horz (isolate 0.152, rank 4): 0,43 59.5,43 59.5,0 0,0
  cutout Top/Horz (isolate 0.305): 0,6.5 32.75,6.5 32.75,0 0,0
  cutout GND/Horz (isolate 0.305): 0,6.5 32.75,6.5 32.75,0 0,0
  cutout Bottom/Vert (isolate 0.305): 0,6.5 32.75,6.5 32.75,0 0,0
  cutout 3.3V/Vert (isolate 0.305): 0,6.5 32.75,6.5 32.75,0 0,0
  cutout Top/Horz (isolate 0.305): 46.34,40.92 48.34,40.92 48.34,38.92 46.34,38.92
  pour 3.3V/Vert (isolate 0.305): 37.25,43 59.5,43 59.5,0 37.25,0
LIPO_RAW
  Bottom/Vert 0.127: MEAS2.1 MEAS2.3
  Bottom/Vert 0.559: J7.2 39.02,11 MEAS2.3
N$1
  Bottom/Vert 0.127: R8.1 33.65,9 35.8,6.85 U10.8
N$2
  Top/Horz 0.127: R11.1 3.78,26.85 D1.A
N$3
  Bottom/Vert 0.127: R7.2 19.64,8.96 19.87,9.19 JP7.3
N$4
  Bottom/Vert 0.127: JP7.1 19.79,10.81 R12.2
N$5
  Top/Horz 0.127: U3.51 54.5,28.3 55.33,29.13 55.33,31.48 R2.1
N$6  (via drill 0.2)
  Top/Horz 0.178: v4.85,29 4.85,32 | 4.85,32 4.85,32.73 v5.12,33.01 | v8.75,32 4.85,32
  Bottom/Vert 0.178: C23.2 C22.1 4.28,33.85 v5.12,33.01 | v8.75,32 R26.1 7.6,31.1 Q3.G2 | Q3.D1 4.8,28.95 v4.85,29
N$7
  Bottom/Vert 0.127: C9.2 18.15,37.85 18,38 Y1.3 16.6,37.83 R13.2 17.25,36.15 U8.33
N$8
  Bottom/Vert 0.127: U8.32 16.75,35.5 16.35,35.9 15.75,35.9 14.85,36.8 R13.1 14.25,36.8 14.15,36.9 14.15,37.2 | 14.15,37.2 14.15,38.8 14.35,39 Y1.1 | C19.2 13.4,37.2 14.15,37.2
N$9
  Bottom/Vert 0.127: U8.35 18.25,35.3 19.05,36.1 21.75,36.1 22.75,37.1 R5.1
N$10
  Bottom/Vert 0.127: U8.28 14.75,34.3 14.45,34.6 14.15,34.6 12.55,36.2 12.55,37.55 R16.2
N$11
  Top/Horz 0.203: U3.40 49.8,15.8 R27.2
N$12
  Top/Horz 0.203: U3.39 48.7,14.9 R28.2
N$13
  Bottom/Vert 0.127: R41.2 40.21,37.39 39.87,37.73 JP3.1
N$14
  Bottom/Vert 0.127: U8.25 12.95,32 12.35,31.4 12.35,30.2 11.65,29.5 R17.2
N$15
  Bottom/Vert 0.127: C21.1 19.7,37.16 17.75,35.2 U8.34
N$16
  Top/Horz 0.127: U3.49 55.25,26.1 R1.1
N$17
  Bottom/Vert 0.127: U8.14 16.75,26.15 C24.1
N$18
  Top/Horz 0.127: U3.50 54.7,27.2 56,28.5 R50.1
N$19  (via drill 0.2)
  GND/Horz 0.127: v15.75,34.8 15.79,34.84 19.09,34.84 19.53,34.4 v24.75,34.4
  Bottom/Vert 0.127: v24.75,34.4 24.89,34.26 24.89,33.86 24.53,33.5 R25.2 | v15.75,34.8 U8.30
N$20  (via drill 0.2)
  GND/Horz 0.127: v24.55,35.1 24.13,35.1 23.99,35.24 16.29,35.24 v16.25,35.2
  Bottom/Vert 0.127: R32.2 v24.55,35.1 | v16.25,35.2 U8.31
N$21  (via drill 0.2)
  Top/Horz 0.127: v13.25,30.4 JP1.2
  Bottom/Vert 0.127: U8.22 13.35,30.5 v13.25,30.4
N$22
  Top/Horz 0.127: U3.46 53.75,22.85 R14.1
N$23  (via drill 0.2)
  Top/Horz 0.127: v13.25,31.6 12.65,31.6 10.84,33.41 JP2.2
  Bottom/Vert 0.127: U8.24 13.35,31.5 v13.25,31.6
N$24
  Bottom/Vert 0.127: Q2.5 22.75,14.4 23.05,14.1 25,14.1 R23.2
N$25
  Bottom/Vert 0.127: R29.2 21.4,13.8 22.65,13.8 22.75,13.7 Q2.2
N$26
  Bottom/Vert 0.203: U9.6 44.79,33.73 R39.2
N$27
  Bottom/Vert 0.203: U9.5 43.69,33.83 44.21,34.35 R40.2
N$28
  Bottom/Vert 0.127: U9.3 41.49,33.3 40.21,34.58 R41.1
N$29
  Bottom/Vert 0.127: U9.4 42.59,35 42.44,35.15 R42.1
N$30
  Bottom/Vert 0.127: R35.1 44.21,17.9 43.69,18.42 U9.20
N$31
  Bottom/Vert 0.127: R36.1 42.59,17.23 U9.21
N$32
  Bottom/Vert 0.127: R37.1 46.86,18.2 46.41,18.2 45.89,18.72 U9.18
N$33
  Bottom/Vert 0.127: U9.19 44.79,18.22 46.16,16.85 R38.1
N$34
  Top/Horz 0.33: FB2.2 49.89,37.8 49.09,37 C32.1 R44.2
N$35
  Bottom/Vert 0.127: R42.2 42.21,37.61 42.49,37.89 JP4.1
N$48
  Top/Horz 0.33: C33.2 U13.2
NEO_!RESET!
  Bottom/Vert 0.127: U9.8 48.89,34.49 48.94,34.54 48.94,35.77 49.37,36.21 TP1.1
NEO_!SAFEBOOT!
  Bottom/Vert 0.127: U9.1 39.29,33.46 37.83,34.92 TP2.1
NEO_DM  (via drill 0.2)
  GND/Horz 0.203: v32.35,30.02 29.31,30.02 28.93,30.41 22.58,30.41 22.53,30.35 v22.2,30.35 | v44.25,38 43.38,38.87 32.82,38.87 32.73,38.78 32.18,38.78 v32.06,38.9
  3.3V/Vert 0.203: v32.35,30.02 32.12,30.25 32.12,38.83 v32.06,38.9
  Bottom/Vert 0.203: R40.1 44.21,37.96 v44.25,38 | U8.6 20.28,30.5 20.48,30.3 20.82,30.3 20.87,30.35 v22.2,30.35
NEO_DP  (via drill 0.2)
  GND/Horz 0.203: v44.57,38.51 43.88,39.2 32.58,39.2 v32.56,39.18 | v32.66,29.65 32.6,29.59 28.08,29.59 28.08,29.6 v23.15,29.6
  3.3V/Vert 0.203: v32.66,29.65 32.66,29.76 32.76,29.86 32.76,30.25 32.45,30.55 32.45,38.73 32.46,38.73 32.46,39.08 v32.56,39.18
  Bottom/Vert 0.203: R39.1 45.56,36.85 44.95,37.46 44.95,38.13 v44.57,38.51 | U8.7 20.31,30 20.35,29.96 22.01,29.96 22.38,29.59 22.92,29.59 22.92,29.6 v23.15,29.6
NEO_RF_IN  (via drill 0.2)
  Top/Horz 0.33: U13.6 51.9,35.2 R43.2 52.1,33.63 v52.17,33.56 v52.18,33.55 v52.18,33.18
  Bottom/Vert 0.33: U9.11 52.19,33.54 v52.17,33.56 52.1,33.63 v52.1,33.95
POWER_BTN  (via drill 0.2)
  Top/Horz 0.127: J8.2 41,37.95 v41.05,38
  Top/Horz 0.178: v9.05,34 3.55,34 3.15,33.6 v3.15,31
  GND/Horz 0.127: v2.85,37.5 16.73,37.5 17.18,37.95 26.79,37.95 26.81,37.93 40.95,37.93 41.02,38 v41.05,38
  3.3V/Vert 0.127: v2.85,37.5 2.85,31.3 v3.15,31
  Bottom/Vert 0.127: C23.1 3.2,37.85 v2.85,37.5
  Bottom/Vert 0.178: v3.15,31 D4.C | R31.1 v9.05,34
PPS
  Top/Horz 0.127: U3.53 54.7,30.5 55.1,30.9 55.1,35.25 R49.1
PROG1
  Bottom/Vert 0.127: U10.6 34.8,7 34.3,7.5 R6.2
RF_IN
  Top/Horz 0.33: J2.FEED 49.91,40 | 49.91,40 50.85,40 51.25,39.6 C33.1 | 49.91,40 49.89,39.98 FB2.1 | D5.1 49.91,40.48 49.91,40
RTK_LV
  Top/Horz 0.127: U3.20 32.75,26.1 R47.1
RX2_LV
  Top/Horz 0.127: U3.26 32.55,19.5 32.45,19.6 32.45,24.52 32.59,24.66 32.59,25.46 32.05,26 R46.1
RXLV
  Top/Horz 0.127: U3.43 54.6,19.5 55.09,19.01 55.09,15.54 R15.1
SCL_LV
  Top/Horz 0.127: U3.45 54.9,21.7 55.34,21.27 55.34,20.53 56,19.87 R9.1
SDA_LV
  Top/Horz 0.127: U3.44 54.7,20.6 55.34,19.96 55.34,15.52 R4.1
TX2_LV
  Top/Horz 0.127: U3.27 32.55,18.4 32.15,18.8 32.15,23.45 31.6,24 R45.1
TXLV
  Top/Horz 0.127: U3.42 53.2,17.9 53.2,16.2 52.75,15.75 R3.1
USB_!RESET
  Bottom/Vert 0.127: U8.26 R18.1 C28.1
USB_DM  (via drill 0.2)
  Top/Horz 0.127: J18.8 20,35.15 v19.75,34.9
  Bottom/Vert 0.127: v19.75,34.9 19.75,33.8 20.05,33.5 R25.1
USB_DP  (via drill 0.2)
  Top/Horz 0.127: v20.29,34.86 20.5,35.07 J18.7
  Bottom/Vert 0.127: v20.29,34.86 20.53,35.1 R32.1
V_BATT  (via drill 0.2)
  Top/Horz 0.305: U4.1 50.95,9.05 | 50.95,9.05 51.65,9.05 C17.1 | U4.3 50.8,10.95 50.95,10.8 50.95,9.05
  Top/Horz 0.559: U4.1 50.05,7.9 49.65,7.5 36.45,7.5 35.48,8.47 MEAS2.4
  GND/Horz 0.305: v5.35,12 17.75,12 18.18,12.43 33.05,12.43 MEAS2.4
  3.3V/Vert 0.305: v5.35,12 5.43,12.08 5.43,20.22 6.15,20.94 6.15,37.5 v6.75,38.1
  Bottom/Vert 0.305: D7.A 5.9,38.1 v6.75,38.1 | 35.75,12 C15.1 35.8,12.1 36.55,12.1 36.75,12.3 36.75,12.7 | MEAS2.2 MEAS2.4 | U7.3 36.9,13.25 36.75,13.1 36.75,12.7 | 36.75,12.7 36.8,12.75 U7.2 | U10.10 36.8,7.35 C3.1 36.3,7.15 U10.9
  Bottom/Vert 0.559: 35.75,12 35.75,10.27 MEAS2.4 35.48,8.67 C3.1
V_RAW  (via drill 0.2)
  GND/Horz 0.305: v7.45,6.5 25.35,6.5 27.05,8.2 33.25,8.2 37.75,3.7 v37.75,1
  3.3V/Vert 0.305: v7.45,6.5 7.45,15.69 7.68,15.92 7.68,22.68 6.75,23.61 v6.75,33
  Bottom/Vert 0.305: Q3.S2 5.75,31 5.9,31.15 R26.2 | R26.2 5.9,33 | 5.9,33 R31.2 5.9,35.8 D7.C D2.C | C22.2 5.75,32.15 R26.2 | 5.9,33 v6.75,33 | U10.2 36.3,1.1 36.4,1 36.8,1 | 36.8,1 v37.75,1 38.3,1 38.5,1.2 C16.1 | U10.1 36.8,1
V_USB  (via drill 0.2)
  Top/Horz 0.305: J15.1 14.5,37.85 14.35,38 13.95,38 | 13.95,38 13.45,38 | 13.45,38 13.05,38 13,37.95 | J15.2 14,37.95 13.95,38 | J15.3 13.5,37.95 13.45,38 | J15.4 13,37.95 | v36.05,34.9 36,34.95 J8.12 | 13,37.95 12.87,37.95 v12.55,38.27
  GND/Horz 0.305: v36.05,38.3 36.02,38.27 v12.55,38.27 8.92,38.27 v8.65,38
  3.3V/Vert 0.305: v36.05,38.3 v36.05,34.9
  Bottom/Vert 0.305: D2.A 7.9,38 v8.65,38 8.5,37.85 8.5,35.2 9.69,34 R21.2
VBUS_DET
  Bottom/Vert 0.127: U8.27 12.6,33 R21.1 R19.2 C29.1
VOUT  (via drill 0.2)
  Top/Horz 0.305: J10.12 27,34.05 26.62,33.67 26.62,26.09 v26.71,26 | J15.9 10.5,37.3 | 10.5,37.3 10.5,39.45 v10.45,39.5 | 11.55,37.3 11.75,37.3 12,37.05 J15.6 | J15.7 11.5,37.25 11.55,37.3 | 11.55,37.3 11.05,37.3 | 11.05,37.3 10.5,37.3 | J15.8 11,37.25 11.05,37.3
  GND/Horz 0.305: v32.12,25.1 32.12,25.63 31.75,26 v26.71,26 v10.31,26 v7.75,26
  3.3V/Vert 0.305: v10.45,39.5 v10.44,39.5 10.32,39.38 10.32,26.01 v10.31,26
  Bottom/Vert 0.305: Q3.D2 6.7,26.1 C20.1 | C20.1 R22.2 | U2.1 31.8,13.95 32.05,14.2 33.7,14.2 | U2.3 33.7,14.2 | 33.7,14.2 33.7,14.9 C6.1 33.55,15 31.73,16.82 31.73,25.1 | U12.1 31.3,28.7 31.73,29.12 | 31.73,29.12 C27.1 | 31.73,25.1 31.73,29.12 | C20.1 v7.75,26 | v32.12,25.1 31.73,25.1
ZED_BACKUP
  Top/Horz 0.127: U3.36 45.4,12.35 45.75,12 C18.1 46.55,10.05 46.55,9.2 46.7,9.05 U4.5
ZED_DM  (via drill 0.2)
  Top/Horz 0.203: v48.75,12.1 R28.1
  GND/Horz 0.203: v48.75,12.1 48.75,10.7 46.65,8.6 34.9,8.6 33.61,9.89 27.59,9.89 v26.85,10.63
  3.3V/Vert 0.203: v26.85,10.63 26.3,11.18 26.3,32.55 v25.95,32.9
  Bottom/Vert 0.203: U8.1 20.33,33 20.55,32.77 23.55,32.77 23.67,32.9 v25.95,32.9
ZED_DP  (via drill 0.2)
  Top/Horz 0.203: R27.1 v50.75,12
  GND/Horz 0.203: v26.85,9.95 27.06,9.95 27.45,9.56 33.47,9.56 34.76,8.27 46.79,8.27 50.52,12 v50.75,12
  3.3V/Vert 0.203: v25.75,32.41 25.97,32.19 25.97,10.84 v26.85,9.96 v26.85,9.95
  Bottom/Vert 0.203: U8.2 20.36,32.5 20.42,32.44 23.68,32.44 23.81,32.57 25.59,32.57 v25.75,32.41
ZED_EXTINT  (via drill 0.2)
  Top/Horz 0.127: U1.5 17.11,36.53 16.45,37.2 v16.45,39.7 | R2.2 56.75,33.85 v56.8,33.8
  3.3V/Vert 0.127: v57.65,39.6 57.63,39.6 57.59,39.56 57.59,35.46 57.35,35.22 57.35,34.35 v56.8,33.8
  Bottom/Vert 0.127: v57.65,39.6 56.75,39.6 56.31,40.04 21.49,40.04 21.15,39.7 v16.45,39.7
ZED_PPS_STAT  (via drill 0.2)
  Top/Horz 0.127: U1.14 19.66,28.91 19.95,29.2 v20.95,29.2 | R49.2 56,39.37 v56.75,40.12
  3.3V/Vert 0.127: v20.95,40.3 21.05,40.2 21.05,29.3 v20.95,29.2 | J4.2 58.6,12.01 58.6,39.43 57.89,40.14 56.77,40.14 v56.75,40.12
  Bottom/Vert 0.127: v20.95,40.3 20.98,40.27 56.6,40.27 v56.75,40.12
ZED_RF_IN
  Top/Horz 0.33: U13.4 50.6,35.2 R43.1 50.41,34.98 50.41,33.91 49.8,33.29 U3.2
ZED_RXI2  (via drill 0.2)
  Top/Horz 0.127: J18.9 19.5,38.95 19.65,39.1 v30.15,39.1 | R46.2 30.15,27 v30.4,27
  3.3V/Vert 0.127: v30.4,27 30.42,27.02 30.42,38.9 30.22,39.1 v30.15,39.1
  Bottom/Vert 0.127: JP3.2 32.9,39 32.43,38.53 30.72,38.53 v30.15,39.1
ZED_TXO2  (via drill 0.2)
  Top/Horz 0.127: J18.10 19,39.02 19.46,39.48 30.47,39.48 v30.65,39.3 | R45.2 29.95,24.8 v30.73,24.8
  3.3V/Vert 0.127: v30.73,24.8 30.84,24.91 30.84,28.13 30.65,28.32 v30.65,39.3
  Bottom/Vert 0.127: JP4.2 41.06,39 40.26,39.8 31.01,39.8 30.65,39.44 v30.65,39.3
ZED_VCC_RF
  Top/Horz 0.406: U3.7 44.3,34.27 45.03,35 R44.1

## Text on the board
Top/Horz: v14
Dimension: Route Out | Route Out
bPlace: + | -
tDocu: Board thickness is 1.6mm | 4 Layer Board | No clean process | Finish: ENIG | Soldermask: Red | Stackup: JLC7628 Impedence Controlled | Material: TG155 | N. Seidle